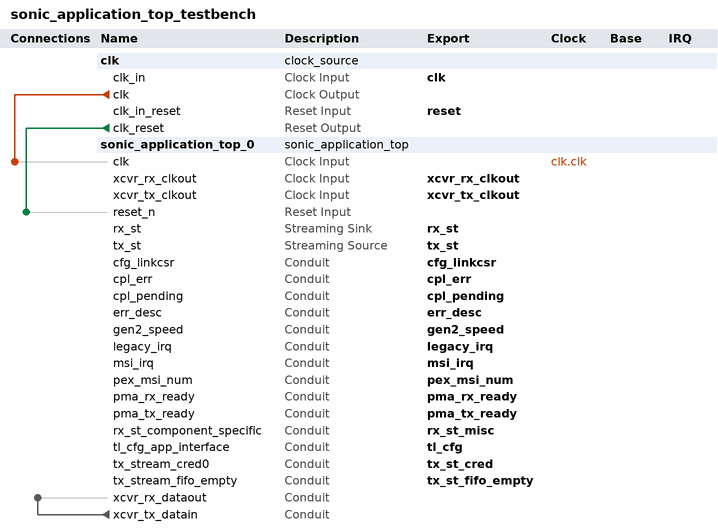
[diagram p0: system contents]
# Platform Designer (Qsys) system sonic_application_top_testbench
# Parameters at their usual value, and those the tool derives, are not listed.
package require -exact qsys 11.0
create_system sonic_application_top_testbench
set_project_property DEVICE_FAMILY STRATIXIV

add_instance clk clock_source 11.0
set_instance_parameter_value clk clockFrequency 250000000

add_instance sonic_application_top_0 sonic_application_top 1.0

# connections
add_connection clk.clk sonic_application_top_0.clk clock
add_connection clk.clk_reset sonic_application_top_0.reset_n reset
add_connection sonic_application_top_0.xcvr_tx_datain sonic_application_top_0.xcvr_rx_dataout conduit

# exported interfaces
add_interface legacy_irq conduit end
set_interface_property legacy_irq EXPORT_OF sonic_application_top_0.legacy_irq
add_interface msi_irq conduit end
set_interface_property msi_irq EXPORT_OF sonic_application_top_0.msi_irq
add_interface err_desc conduit end
set_interface_property err_desc EXPORT_OF sonic_application_top_0.err_desc
add_interface pex_msi_num conduit end
set_interface_property pex_msi_num EXPORT_OF sonic_application_top_0.pex_msi_num
add_interface rx_st avalon_streaming sink
set_interface_property rx_st EXPORT_OF sonic_application_top_0.rx_st
add_interface tx_st avalon_streaming source
set_interface_property tx_st EXPORT_OF sonic_application_top_0.tx_st
add_interface rx_st_misc conduit end
set_interface_property rx_st_misc EXPORT_OF sonic_application_top_0.rx_st_component_specific
add_interface cpl_err conduit end
set_interface_property cpl_err EXPORT_OF sonic_application_top_0.cpl_err
add_interface cpl_pending conduit end
set_interface_property cpl_pending EXPORT_OF sonic_application_top_0.cpl_pending
add_interface tl_cfg conduit end
set_interface_property tl_cfg EXPORT_OF sonic_application_top_0.tl_cfg_app_interface
add_interface tx_st_cred conduit end
set_interface_property tx_st_cred EXPORT_OF sonic_application_top_0.tx_stream_cred0
add_interface tx_st_fifo_empty conduit end
set_interface_property tx_st_fifo_empty EXPORT_OF sonic_application_top_0.tx_stream_fifo_empty
add_interface xcvr_rx_clkout clock sink
set_interface_property xcvr_rx_clkout EXPORT_OF sonic_application_top_0.xcvr_rx_clkout
add_interface xcvr_tx_clkout clock sink
set_interface_property xcvr_tx_clkout EXPORT_OF sonic_application_top_0.xcvr_tx_clkout
add_interface cfg_linkcsr conduit end
set_interface_property cfg_linkcsr EXPORT_OF sonic_application_top_0.cfg_linkcsr
add_interface gen2_speed conduit end
set_interface_property gen2_speed EXPORT_OF sonic_application_top_0.gen2_speed
add_interface clk clock sink
set_interface_property clk EXPORT_OF clk.clk_in
add_interface reset reset sink
set_interface_property reset EXPORT_OF clk.clk_in_reset
add_interface pma_tx_ready conduit end
set_interface_property pma_tx_ready EXPORT_OF sonic_application_top_0.pma_tx_ready
add_interface pma_rx_ready conduit end
set_interface_property pma_rx_ready EXPORT_OF sonic_application_top_0.pma_rx_ready

save_system sonic_application_top_testbench.qsys
